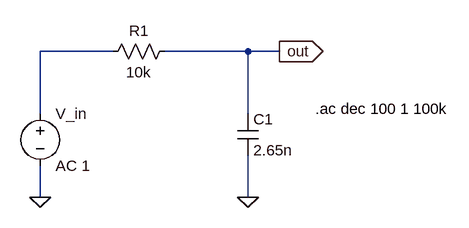
[diagram p0: schematic Low Pass.asc]
Low Pass.asc, the LTspice schematic file:
Version 4.1
SHEET 1 880 680
WIRE 208 48 96 48
WIRE 416 48 288 48
WIRE 464 48 416 48
WIRE 96 144 96 48
WIRE 416 144 416 48
WIRE 96 272 96 224
WIRE 416 272 416 208
FLAG 96 272 0
FLAG 416 272 0
FLAG 464 48 out
IOPIN 464 48 Out
SYMBOL voltage 96 128 R0
SYMATTR InstName V_in
SYMATTR Value AC 1
SYMBOL res 304 32 R90
WINDOW 0 0 56 VBottom 2
WINDOW 3 32 56 VTop 2
SYMATTR InstName R1
SYMATTR Value 10k
SYMBOL cap 400 144 R0
SYMATTR InstName C1
SYMATTR Value 2.65n
TEXT 520 136 Left 2 !.ac dec 100 1 100k

The netlist it stands for:
* Low Pass.asc
V_in N001 0 AC 1
R1 out N001 10k
C1 out 0 2.65n
.ac dec 100 1 100k
.backanno
.end

* Results of the author's LTspice run, read from the files saved beside the schematic
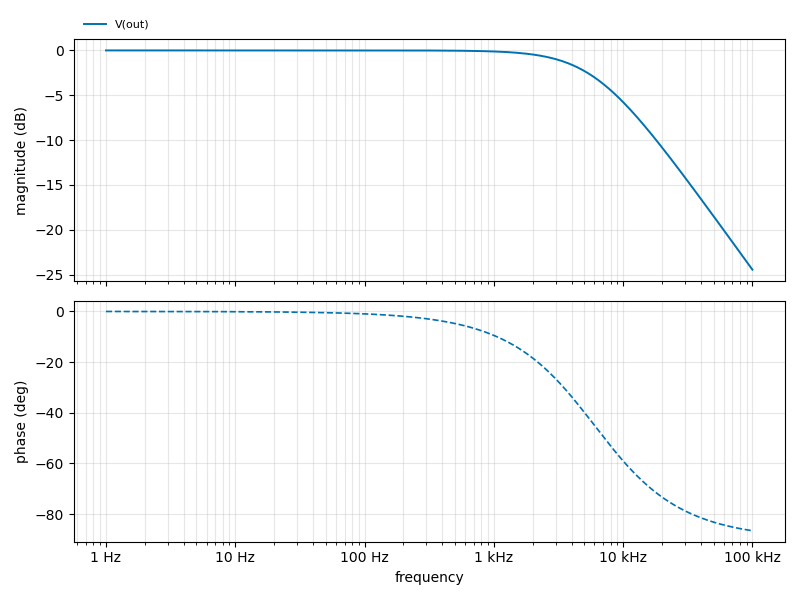
[diagram p1: AC Analysis of Low Pass.asc, plotted from the saved traces]
* AC Analysis, 1 run:
*   V(out): -0.00 dB at 1 Hz, -24.44 dB at 100 kHz, peak -0.00 dB at 1 Hz, 3 dB below the peak at 6.006 kHz